# Altium project MSampler3.PrjPcb
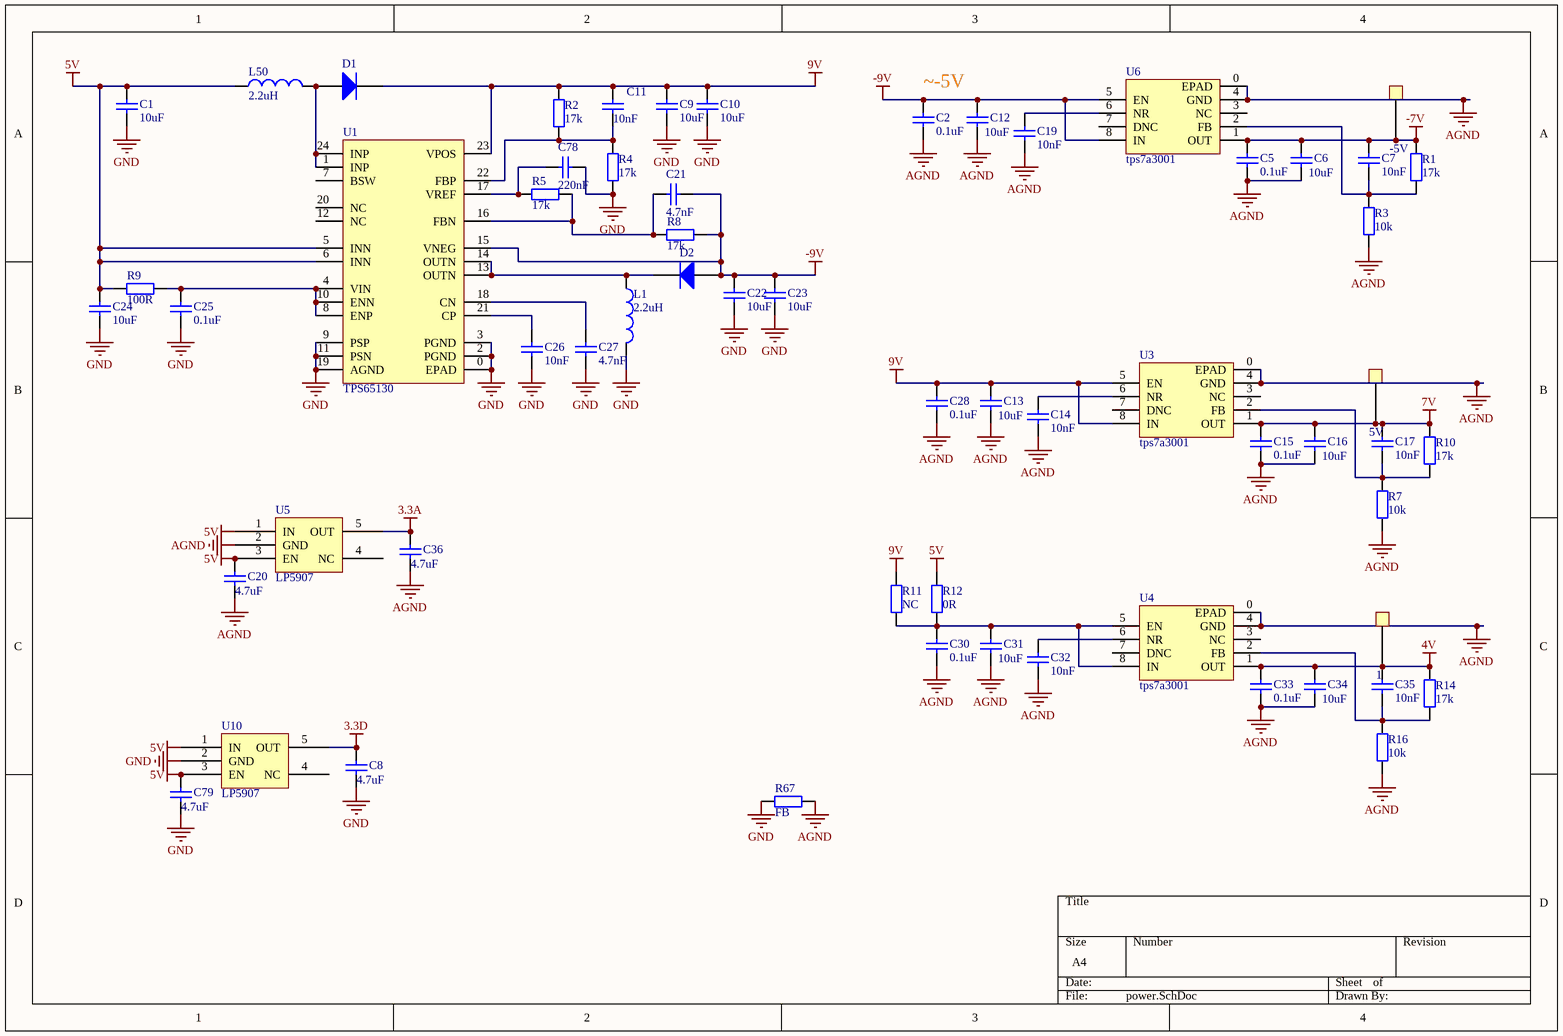
[diagram p0: power.SchDoc]
3 sheets, 179 parts. Net scope: flat (ports and power ports of the same name join across sheets).
Board file: MSampler3.PcbDoc
Sheets:
  power.SchDoc
  audio.SchDoc
  MCU.SchDoc

## Sheet power.SchDoc
size A4

### Parts
1  TestPad  [TestPad]  (value not drawn)
5V  TestPad  [TestPad]  (value not drawn)
-5V  TestPad  [TestPad]  (value not drawn)
C1  10uF  [0603L]
C2  0.1uF  [0603L]
C5  0.1uF  [0603L]
C6  10uF  [0805]
C7  10nF  [0402]
C8  4.7uF  [0603L]
C9  10uF  [0603L]
C10  10uF  [0603L]
C11  10nF  [0402]
C12  10uF  [0805]
C13  10uF  [0805]
C14  10nF  [0402]
C15  0.1uF  [0603L]
C16  10uF  [0805]
C17  10nF  [0402]
C19  10nF  [0402]
C20  4.7uF  [0603L]
C21  4.7nF  [0402]
C22  10uF  [0603L]
C23  10uF  [0603L]
C24  10uF  [0603L]
C25  0.1uF  [0402]
C26  10nF  [0402]
C27  4.7nF  [0402]
C28  0.1uF  [0603L]
C30  0.1uF  [0603L]
C31  10uF  [0805]
C32  10nF  [0402]
C33  0.1uF  [0603L]
C34  10uF  [0805]
C35  10nF  [0402]
C36  4.7uF  [0603L]
C78  220nF  [0402]
C79  4.7uF  [0603L]
D1  (no value)  [LC-SOD-323]
D2  (no value)  [LC-SOD-323]
L1  2.2uH  [L4015]
L50  2.2uH  [L4015]
R1  17k  [0402]
R2  17k  [0402]
R3  10k  [0402]
R4  17k  [0402]
R5  17k  [0402]
R7  10k  [0402]
R8  17k  [0402]
R9  100R  [0402]
R10  17k  [0402]
R11  NC  [0402]
R12  0R  [0402]
R14  17k  [0402]
R16  10k  [0402]
R67  FB  [0603L]
U1  TPS65130  [TPS65130]
U3  tps7a3001  [MSOP8/VSSOP8+PAD]
U4  tps7a3001  [MSOP8/VSSOP8+PAD]
U5  LP5907  [SOT23-5]
U6  tps7a3001  [MSOP8/VSSOP8+PAD]
U10  LP5907  [SOT23-5]

### Nets
3.3A: C36.2 U5.5(OUT)
3.3D: C8.2 U10.5(OUT)
4V: 1.1 C33.1 C34.2 C35.1 R14.2 U4.1(OUT)
5V: C1.1 C20.2 C24.1 C79.2 L50.1 R9.2 R12.2 U1.5(INN) U1.6(INN) U5.1(IN) U5.3(EN) U10.1(IN) U10.3(EN)
7V: 5V.1 C15.1 C16.2 C17.1 R10.2 U3.1(OUT)
9V: C9.1 C10.1 C11.1 C13.2 C28.1 D1.2(K) R2.2 R11.2 U1.23(VPOS) U3.5(EN) U3.8(IN)
-7V: -5V.1 C5.1 C6.2 C7.1 R1.2 U6.1(OUT)
-9V: C2.1 C12.2 C21.2 C22.1 C23.1 D2.1(A) R8.2 U1.15(VNEG) U6.5(EN) U6.8(IN)
AGND: C2.2 C5.2 C6.1 C12.1 C13.1 C14.2 C15.2 C16.1 C19.2 C20.1 C28.2 C30.2 C31.1 C32.2 C33.2 C34.1 C36.1 R3.1 R7.1 R16.1 R67.1 U3.0(EPAD) U3.4(GND) U4.0(EPAD) U4.4(GND) U5.2(GND) U6.0(EPAD) U6.4(GND)
GND: C1.2 C8.1 C9.2 C10.2 C22.2 C23.2 C24.2 C25.2 C26.2 C27.2 C78.2 C79.1 L1.2 R4.1 R67.2 U1.0(EPAD) U1.2(PGND) U1.3(PGND) U1.9(PSP) U1.11(PSN) U1.19(AGND) U10.2(GND)
NetC7_2: C7.2 R1.1 R3.2 U6.2(FB)
NetC11_2: C11.2 R2.1 R4.2 U1.22(FBP)
NetC14_1: C14.1 U3.6(NR)
NetC17_2: C17.2 R7.2 R10.1 U3.2(FB)
NetC19_1: C19.1 U6.6(NR)
NetC21_1: C21.1 R5.1 R8.1 U1.16(FBN)
NetC25_1: C25.1 R9.1 U1.4(VIN) U1.8(ENP) U1.10(ENN)
NetC26_1: C26.1 U1.21(CP)
NetC27_1: C27.1 U1.18(CN)
NetC30_1: C30.1 C31.2 R11.1 R12.1 U4.5(EN) U4.8(IN)
NetC32_1: C32.1 U4.6(NR)
NetC35_2: C35.2 R14.1 R16.2 U4.2(FB)
NetC78_1: C78.1 R5.2 U1.17(VREF)
NetD1_1: D1.1(A) L50.2 U1.1(INP) U1.24(INP)
NetD2_2: D2.2(K) L1.1 U1.13(OUTN) U1.14(OUTN)

Not connected (* = marked no-connect by the designer): U1 7(BSW) 12(NC) 20(NC); U3 3(NC) 7(DNC); U4 3(NC) 7(DNC); U5 4(NC); U6 3(NC) 7(DNC); U10 4(NC)

### Notes on the sheet
- ~-5V

### Library data of the parts
C1 C2 C5-C17 C19-C28 C30-C36 C78 C79 = Cap: Capacitor; Published: 8-Jun-2000; LatestRevisionDate: 17-Jul-2002; LatestRevisionNote: Re-released for DXP Platform.; PackageReference: RAD-0.3; Publisher: Altium Limited; PackageDescription: Radial Cap, Thru-Hole; 2 Leads; 0.3 in Pin Spacing
D1 D2 = Diode 1N4148: High Conductance Fast Diode; Published: 8-Jun-2000; LatestRevisionDate: 17-Jul-2002; LatestRevisionNote: Re-released for DXP Platform.; DatasheetVersion: 1997; PackageReference: DO-35; Publisher: Altium Limited; PackageDescription: Diode, Axial; Body 3.8 x 1.9 mm (LxDia. max), Lead Dia. 0.53 mm (max); Code_JEDEC: DO-204-AH; ComponentLink1Description: Manufacturer Link; ComponentLink1URL: http://www.fairchildsemi.com/; ComponentLink2Description: Datasheet; ComponentLink2URL: http://www.fairchildsemi.com/ds/1N%2F1N4148.pdf
L1 L50 = Inductor: Code_IEC: 1005; Published: 8-Jun-2000; LatestRevisionDate: 29-May-2009; LatestRevisionNote: IPC-7351 Footprint Added.; PackageReference: 0402-A; Publisher: Altium Limited; PackageDescription: Chip Inductor; Code_JEITA: 0402
R1-R5 R7-R12 R14 R16 R67 = Res2: Resistor; Published: 8-Jun-2000; LatestRevisionDate: 17-Jul-2002; LatestRevisionNote: Re-released for DXP Platform.; PackageReference: AXIAL-0.4; Publisher: Altium Limited; PackageDescription: Axial Device, Thru-Hole; 2 Leads; 0.4 in Pin Spacing

## Sheet audio.SchDoc
size A3
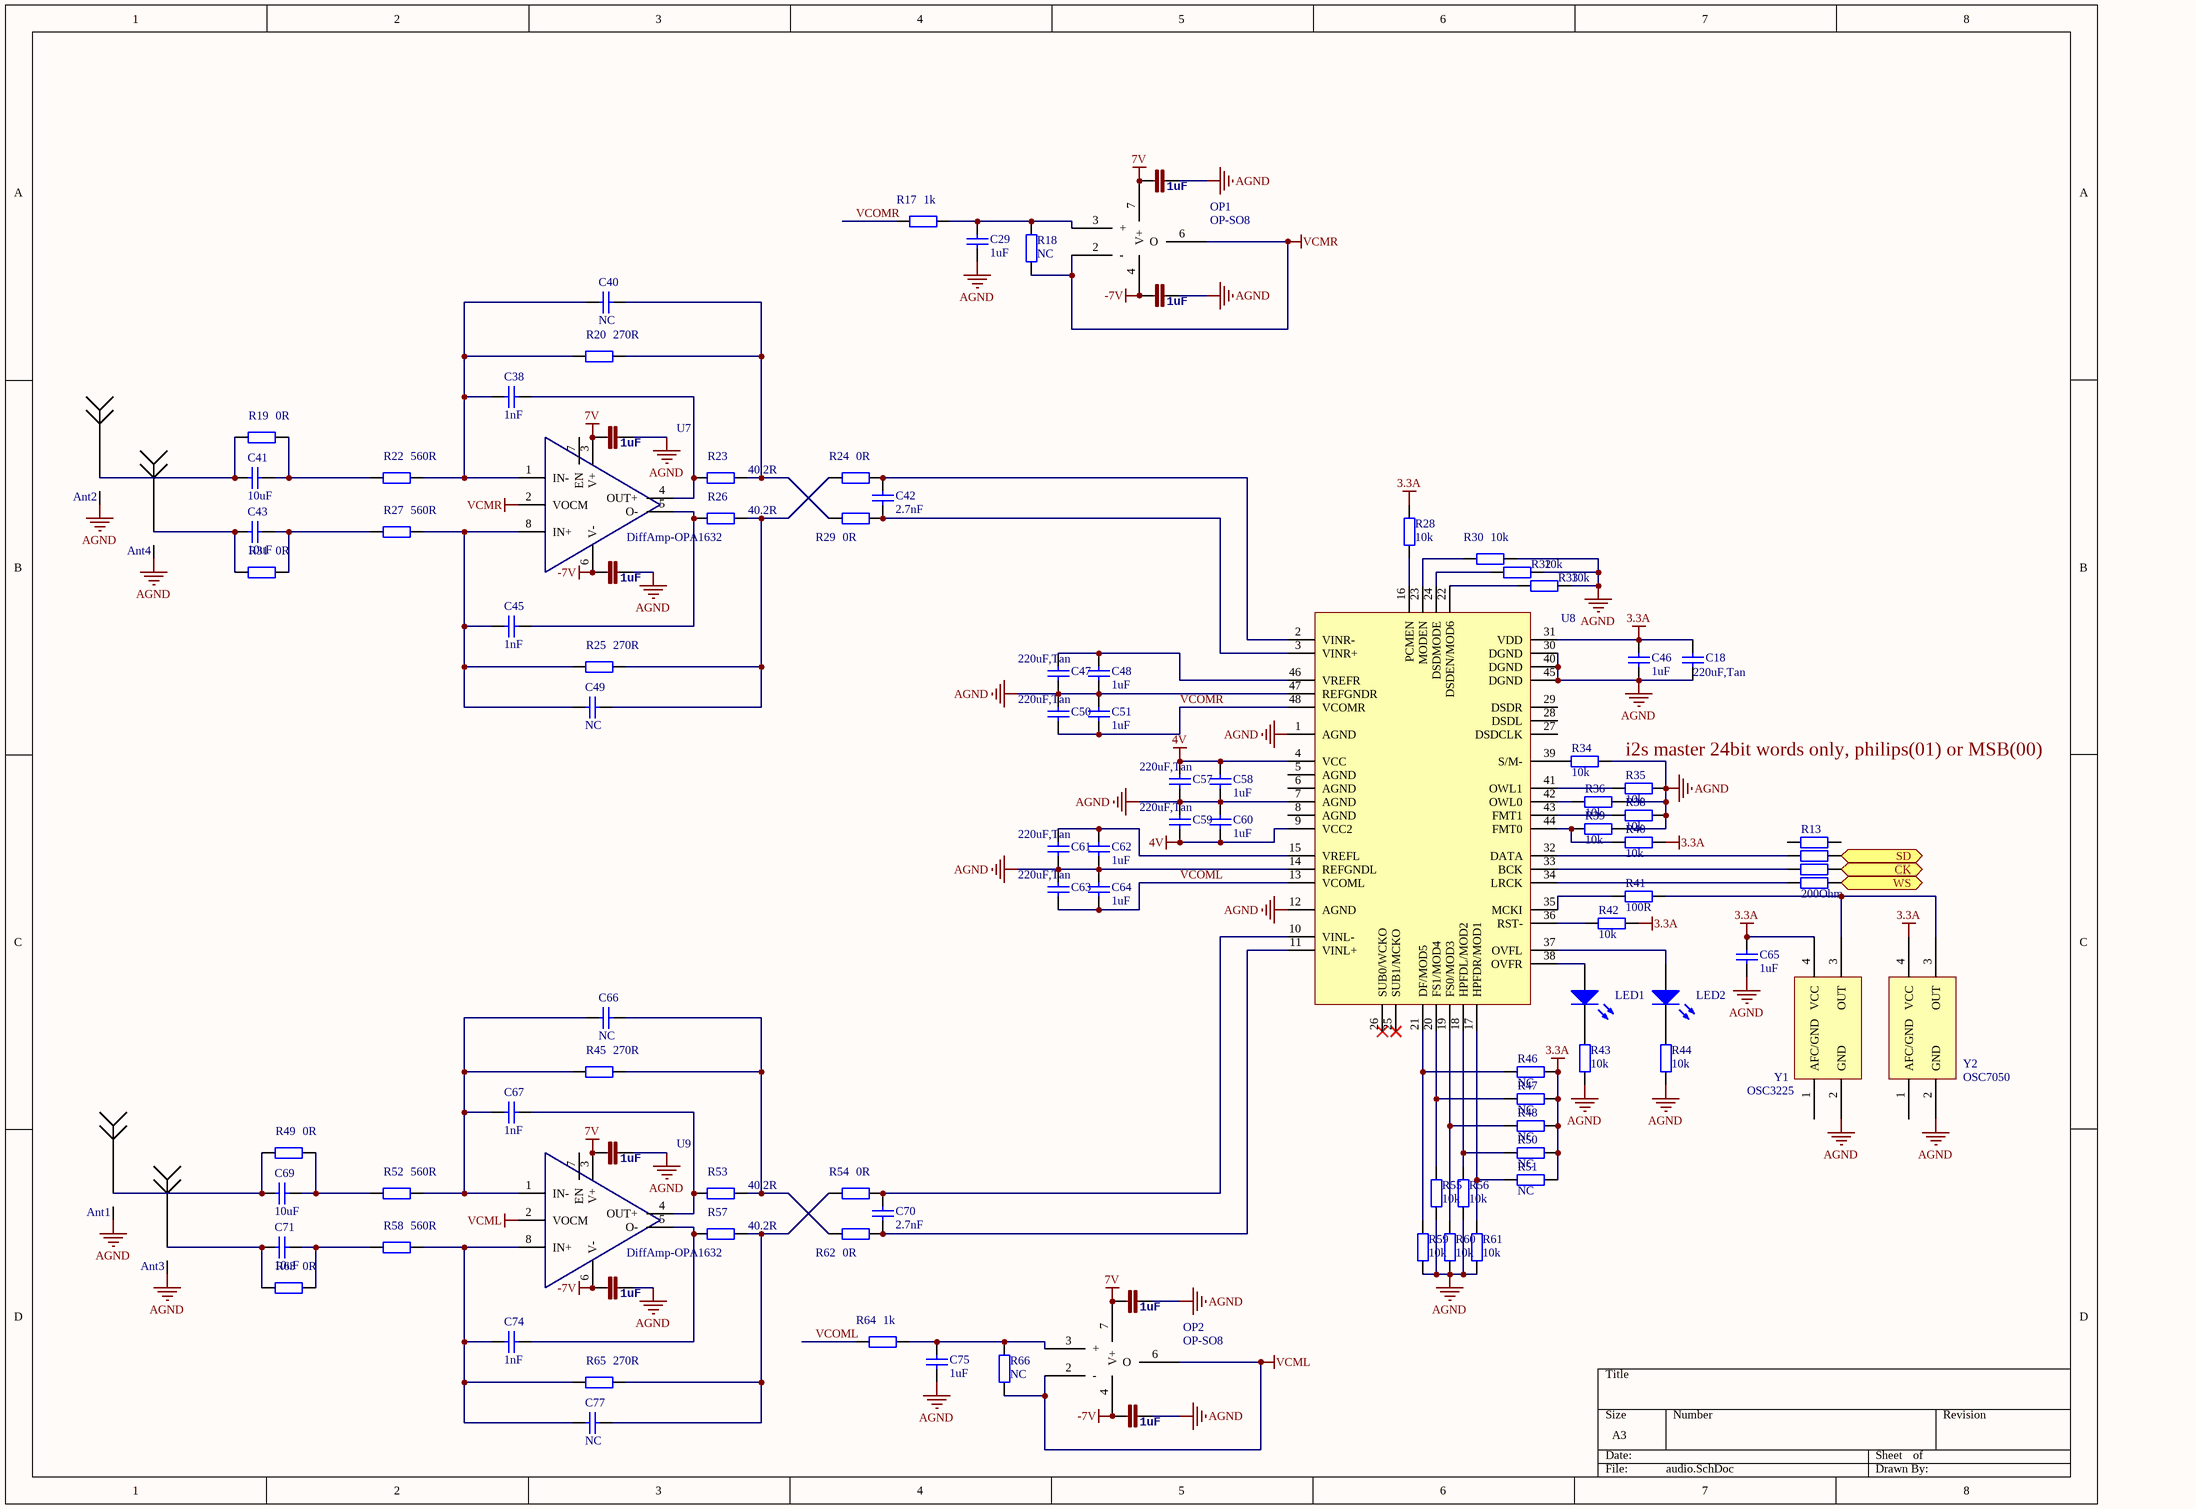
[diagram p1: audio.SchDoc]

### Parts
Ant1  Antenna  [SMA-2C]  (value not drawn)
Ant2  Antenna  [SMA-2C]  (value not drawn)
Ant3  Antenna  [SMA-2C]  (value not drawn)
Ant4  Antenna  [SMA-2C]  (value not drawn)
C18  220uF,Tan  [1210]
C29  1uF  [0402]
C37  1uF  [0603L]
C38  1nF  [0805]
C39  1uF  [0603L]
C40  NC  [0805]
C41  10uF  [CL21-5mm-1F]
C42  2.7nF  [0805]
C43  10uF  [CL21-5mm-1F]
C44  1uF  [0603L]
C45  1nF  [0805]
C46  1uF  [0402]
C47  220uF,Tan  [1210]
C48  1uF  [0402]
C49  NC  [0805]
C50  220uF,Tan  [1210]
C51  1uF  [0402]
C57  220uF,Tan  [1210]
C58  1uF  [0402]
C59  220uF,Tan  [1210]
C60  1uF  [0402]
C61  220uF,Tan  [1210]
C62  1uF  [0402]
C63  220uF,Tan  [1210]
C64  1uF  [0402]
C65  1uF  [0402]
C66  NC  [0805]
C67  1nF  [0805]
C68  1uF  [0603L]
C69  10uF  [CL21-5mm-1F]
C70  2.7nF  [0805]
C71  10uF  [CL21-5mm-1F]
C72  1uF  [0603L]
C73  1uF  [0603L]
C74  1nF  [0805]
C75  1uF  [0402]
C76  1uF  [0603L]
C77  NC  [0805]
C89  1uF  [0603L]
LED1  LED0  [0603]  (value not drawn)
LED2  LED0  [0603]  (value not drawn)
OP1  OP-SO8  [D8]
OP2  OP-SO8  [D8]
R13  value 200Ohm  [0402X4]  (hidden comment: Res*4)
R17  1k  [0402]
R18  NC  [0402]
R19  0R  [0402]
R20  270R  [0402]
R22  560R  [0402]
R23  40.2R  [0805]
R24  0R  [0402]
R25  270R  [0402]
R26  40.2R  [0805]
R27  560R  [0402]
R28  10k  [0402]
R29  0R  [0402]
R30  10k  [0402]
R31  0R  [0402]
R32  10k  [0402]
R33  10k  [0402]
R34  10k  [0402]
R35  10k  [0402]
R36  10k  [0402]
R38  10k  [0402]
R39  10k  [0402]
R40  10k  [0402]
R41  100R  [0402]
R42  10k  [0402]
R43  10k  [0402]
R44  10k  [0402]
R45  270R  [0402]
R46  NC  [0402]
R47  NC  [0402]
R48  NC  [0402]
R49  0R  [0402]
R50  NC  [0402]
R51  NC  [0402]
R52  560R  [0402]
R53  40.2R  [0805]
R54  0R  [0402]
R55  10k  [0402]
R56  10k  [0402]
R57  40.2R  [0805]
R58  560R  [0402]
R59  10k  [0402]
R60  10k  [0402]
R61  10k  [0402]
R62  0R  [0402]
R63  0R  [0402]
R64  1k  [0402]
R65  270R  [0402]
R66  NC  [0402]
U7  DiffAmp-OPA1632  [MSOP8/VSSOP8]
U8  PCM4222-FUNC  [PCM4222]  (value not drawn)
U9  DiffAmp-OPA1632  [MSOP8/VSSOP8]
Y1  OSC3225  [TXC_7Q]
Y2  OSC7050  [OSC7050]

### Ports
CK, SD, WS

### Nets
3.3A: C18.2 C46.2 C65.2 R28.1 R40.2 R42.2 R46.1 R47.2 R48.2 R50.2 R51.1 U8.31(VDD) Y1.4(VCC) Y2.4(VCC)
4V: C57.1 C58.2 C59.2 C60.1 U8.4(VCC) U8.9(VCC2)
7V: C39.2 C68.2 C73.2 C89.2 OP1.7(V+) OP2.7(V+) U7.3(V+) U9.3(V+)
-7V: C37.2 C44.2 C72.2 C76.2 OP1.4 OP2.4 U7.6(V-) U9.6(V-)
AGND: Ant1.GND(G) Ant2.GND(G) Ant3.GND(G) Ant4.GND(G) C18.1 C29.1 C37.1 C39.1 C44.1 C46.1 C47.2 C48.1 C50.1 C51.2 C57.2 C58.1 C59.1 C60.2 C61.2 C62.1 C63.1 C64.2 C65.1 C68.1 C72.1 C73.1 C75.1 C76.1 C89.1 R30.1 R32.1 R33.1 R34.2 R35.2 R36.2 R38.2 R39.2 R43.2 R44.2 R55.1 R56.1 R59.1 R60.1 R61.1 U8.1(AGND) U8.7(AGND) U8.12(AGND) U8.14(REFGNDL) U8.30(DGND) U8.40(DGND) U8.45(DGND) U8.47(REFGNDR) Y1.2(GND) Y2.2(GND)
VCML: OP2.2(-) OP2.6(O) R66.2 U9.2(VOCM)
VCMR: OP1.2(-) OP1.6(O) R18.2 U7.2(VOCM)
PA15: R13.8 ; port WS
VCOML: C63.2 C64.1 R64.2 U8.13(VCOML)
VCOMR: C50.2 C51.1 R17.2 U8.48(VCOMR)
NetAnt1_1: Ant1.1 C69.2 R49.2
NetAnt2_1: Ant2.1 C41.2 R19.2
NetAnt3_1: Ant3.1 C71.2 R63.2
NetAnt4_1: Ant4.1 C43.2 R31.2
NetC29_2: C29.2 OP1.3(+) R17.1 R18.1
NetC38_1: C38.1 R23.2 U7.4(OUT+)
NetC38_2: C38.2 C40.2 R20.2 R22.1 U7.1(IN-)
NetC40_1: C40.1 R20.1 R23.1 R29.2
NetC41_1: C41.1 R19.1 R22.2
NetC42_1: C42.1 R24.1 U8.2(VINR-)
NetC42_2: C42.2 R29.1 U8.3(VINR+)
NetC43_1: C43.1 R27.2 R31.1
NetC45_1: C45.1 R26.2 U7.5(O-)
NetC45_2: C45.2 C49.2 R25.2 R27.1 U7.8(IN+)
NetC47_1: C47.1 C48.2 U8.46(VREFR)
NetC49_1: C49.1 R24.2 R25.1 R26.1
NetC61_1: C61.1 C62.2 U8.15(VREFL)
NetC66_1: C66.1 R45.1 R53.1 R62.2
NetC66_2: C66.2 C67.2 R45.2 R52.1 U9.1(IN-)
NetC67_1: C67.1 R53.2 U9.4(OUT+)
NetC69_1: C69.1 R49.1 R52.2
NetC70_1: C70.1 R54.1 U8.10(VINL-)
NetC70_2: C70.2 R62.1 U8.11(VINL+)
NetC71_1: C71.1 R58.2 R63.1
NetC74_1: C74.1 R57.2 U9.5(O-)
NetC74_2: C74.2 C77.2 R58.1 R65.2 U9.8(IN+)
NetC75_2: C75.2 OP2.3(+) R64.1 R66.1
NetC77_1: C77.1 R54.2 R57.1 R65.1
NetLED1_1: LED1.1(A) U8.38(OVFR)
NetLED1_2: LED1.2(K) R43.1
NetLED2_1: LED2.1(A) U8.37(OVFL)
NetLED2_2: LED2.2(K) R44.1
NetR13_1: R13.1 U8.34(LRCK)
NetR13_2: R13.2 U8.33(BCK)
NetR13_3: R13.3 U8.32(DATA)
NetR13_6: R13.6 ; port SD
NetR13_7: R13.7 ; port CK
NetR28_2: R28.2 U8.16(PCMEN)
NetR30_2: R30.2 U8.23(MODEN)
NetR32_2: R32.2 U8.24(DSDMODE)
NetR33_2: R33.2 U8.22(DSDEN/MOD6)
NetR34_1: R34.1 U8.39(S/M-)
NetR35_1: R35.1 U8.41(OWL1)
NetR36_1: R36.1 U8.42(OWL0)
NetR38_1: R38.1 U8.43(FMT1)
NetR39_1: R39.1 R40.1 U8.44(FMT0)
NetR41_1: R41.1 U8.35(MCKI)
NetR41_2: R41.2 Y1.3(OUT) Y2.3(OUT)
NetR42_1: R42.1 U8.36(RST-)
NetR46_2: R46.2 R59.2 U8.21(DF/MOD5)
NetR47_1: R47.1 R55.2 U8.20(FS1/MOD4)
NetR48_1: R48.1 R60.2 U8.19(FS0/MOD3)
NetR50_1: R50.1 R56.2 U8.18(HPFDL/MOD2)
NetR51_2: R51.2 R61.2 U8.17(HPFDR/MOD1)

Not connected (* = marked no-connect by the designer): R13 4 5; U7 7(EN); U8 5(AGND) 6(AGND) 8(AGND) 25(SUB1/MCKO)* 26(SUB0/WCKO)* 27(DSDCLK) 28(DSDL) 29(DSDR); U9 7(EN); Y1 1(AFC/GND); Y2 1(AFC/GND)

### Notes on the sheet
- i2s master 24bit words only, philips(01) or MSB(00)

### Library data of the parts
C18 C29 C38 C40-C43 C45-C51 C57-C67 C69-C71 C74 C75 C77 = Cap: Capacitor
  C18 C38 C40-C43 C45 C47 C49 C50 C57 C59 C61 C63 C66 C67 C69-C71 C74 C77: Published: 8-Jun-2000; LatestRevisionDate: 17-Jul-2002; LatestRevisionNote: Re-released for DXP Platform.; PackageReference: RAD-0.3; Publisher: Altium Limited; PackageDescription: Radial Cap, Thru-Hole; 2 Leads; 0.3 in Pin Spacing
C37 C39 C44 C68 C72 C73 C76 C89 = CAP0402-CAP: <b>Capacitor</b> / Standard 0603 ceramic capacitor, and 0.1" leaded capacitor.; PARTNO: CC0402ZRY5V7BB104
LED1 LED2 = LED0: Typical INFRARED GaAs LED; Published: 8-Jun-2000; LatestRevisionDate: 08-Jul-2005; LatestRevisionNote: Mech Layer 1 removed.; PackageReference: LED-0; Publisher: Altium Limited; PackageDescription: LED; 2 Leads
R13 = Res*4: Resistor; Published: 8-Jun-2000; LatestRevisionDate: 17-Jul-2002; LatestRevisionNote: Re-released for DXP Platform.; PackageReference: AXIAL-0.4; Publisher: Altium Limited; PackageDescription: Axial Device, Thru-Hole; 2 Leads; 0.4 in Pin Spacing
R17 R18 R23 R24 R26 R28-R30 R32 R33 R53 R54 R57 R62 R64 R66 = Res2: Resistor; Published: 8-Jun-2000; LatestRevisionDate: 17-Jul-2002; LatestRevisionNote: Re-released for DXP Platform.; PackageReference: AXIAL-0.4; Publisher: Altium Limited; PackageDescription: Axial Device, Thru-Hole; 2 Leads; 0.4 in Pin Spacing
R19 R20 R22 R25 R27 R31 R34-R36 R38-R52 R55 R56 R58-R61 R63 R65 = Res2: Resistor; Value: 0Ohm; Published: 8-Jun-2000; LatestRevisionDate: 17-Jul-2002; LatestRevisionNote: Re-released for DXP Platform.; PackageReference: AXIAL-0.4; Publisher: Altium Limited; PackageDescription: Axial Device, Thru-Hole; 2 Leads; 0.4 in Pin Spacing
U7 U9 = DiffAmp
Y1 Y2 = OSC_40M

## Sheet MCU.SchDoc
size A4
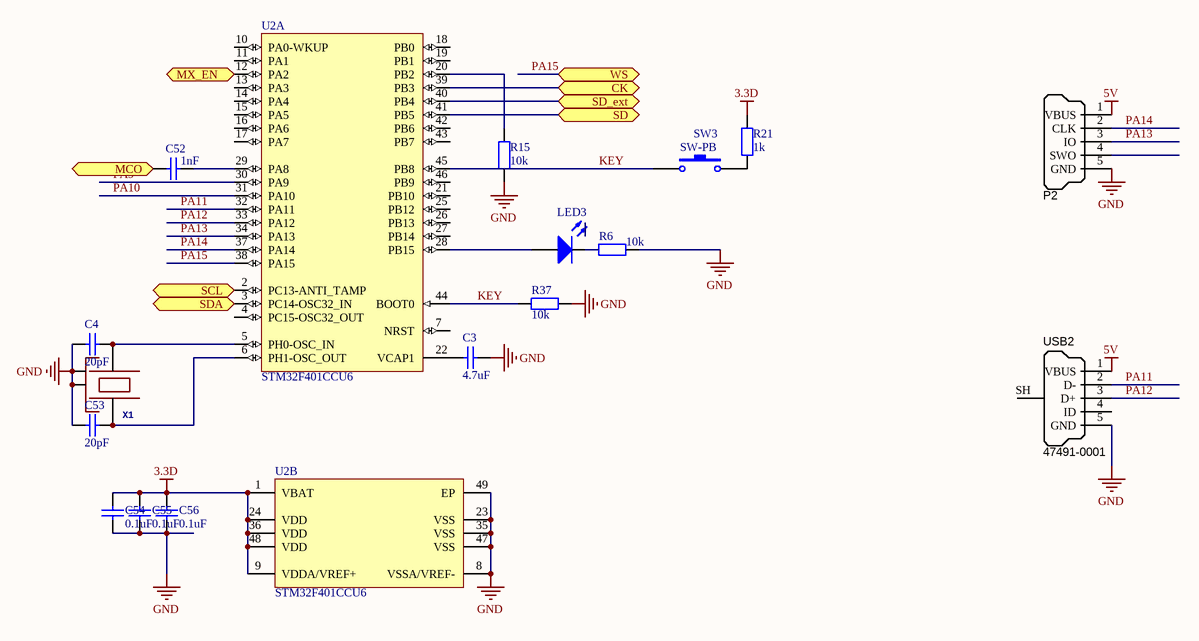
[diagram p2: MCU.SchDoc]

### Parts
C3  value 4.7uF  [0603L]  (hidden comment: Cap)
C4  value 20pF  [0402]  (hidden comment: Cap)
C52  1nF  [0402]
C53  value 20pF  [0402]  (hidden comment: Cap)
C54  value 0.1uF  [0402]  (hidden comment: Cap)
C55  value 0.1uF  [0402]  (hidden comment: Cap)
C56  value 0.1uF  [0402]  (hidden comment: Cap)
LED3  LED0  [0603]  (value not drawn)
P2  SWD_MicroUSB  [MICRO-YZX]  (value not drawn)
R6  10k  [0402]
R15  10k  [0402]
R21  1k  [0402]
R37  value 10k  [0402]  (hidden comment: Res2)
SW3  SW-PB  [SW3x4]
U2  STM32F401CCU6  [STM-UFQFPN48_N]  (parts A,B of 2)
USB2  Manufacturer Part Number 1: 47491-0001  [MICRO-YZX]  (hidden comment: USB Micro Type B)
X1  24.000 KHz 3.2x2.5mm 8-10pf  [OSCILLATOR-2.5x2.0]  (value not drawn)

### Ports
CK, MCO, MX_EN, SCL, SD, SD_ext, SDA, WS

### Nets
3.3D: C54.2 C55.2 C56.2 R21.2 U2.1(VBAT) U2.9(VDDA/VREF+) U2.24(VDD) U2.36(VDD) U2.48(VDD)
5V: P2.1(VBUS) USB2.1(VBUS)
GND: C3.1 C4.1 C53.1 C54.1 C55.1 C56.1 P2.5(GND) R6.2 R15.2 R37.2 U2.8(VSSA/VREF-) U2.23(VSS) U2.35(VSS) U2.47(VSS) U2.49(EP) USB2.5(GND) X1.2(NC_2) X1.4(NC_4)
KEY: R37.1 SW3.1 U2.44(BOOT0) U2.45(PB8)
PA9: U2.30(PA9)
PA10: U2.31(PA10)
PA11: U2.32(PA11) USB2.2(D-)
PA12: U2.33(PA12) USB2.3(D+)
PA13: P2.3(IO) U2.34(PA13)
PA14: P2.2(CLK) U2.37(PA14)
PA15: U2.38(PA15) ; port WS
NetC3_2: C3.2 U2.22(VCAP1)
NetC4_2: C4.2 U2.5(PH0-OSC_IN) X1.1
NetC52_1: C52.1 ; port MCO
NetC52_2: C52.2 U2.29(PA8)
NetC53_2: C53.2 U2.6(PH1-OSC_OUT) X1.3
NetLED3_1: LED3.1(A) U2.28(PB15)
NetLED3_2: LED3.2(K) R6.1
NetR13_6: U2.41(PB5) ; port SD
NetR13_7: U2.39(PB3) ; port CK
NetR15_1: R15.1 U2.20(PB2)
NetR21_1: R21.1 SW3.2
NetU2_2: U2.2(PC13-ANTI_TAMP) ; port SCL
NetU2_3: U2.3(PC14-OSC32_IN) ; port SDA
NetU2_12: U2.12(PA2) ; port MX_EN
NetU2_40: U2.40(PB4) ; port SD_ext

Not connected (* = marked no-connect by the designer): P2 4(SWO); U2 4(PC15-OSC32_OUT) 7(NRST) 10(PA0-WKUP) 11(PA1) 13(PA3) 14(PA4) 15(PA5) 16(PA6) 17(PA7) 18(PB0) 19(PB1) 21(PB10) 25(PB12) 26(PB13) 27(PB14) 42(PB6) 43(PB7) 46(PB9); USB2 4(ID) SH(Shell)

### Library data of the parts
C3 C4 C52-C56 = Cap: Capacitor
  C3 C4 C53-C56: Published: 8-Jun-2000; LatestRevisionDate: 17-Jul-2002; LatestRevisionNote: Re-released for DXP Platform.; PackageReference: RAD-0.3; Publisher: Altium Limited; PackageDescription: Radial Cap, Thru-Hole; 2 Leads; 0.3 in Pin Spacing
LED3 = LED0: Typical INFRARED GaAs LED; Published: 8-Jun-2000; LatestRevisionDate: 08-Jul-2005; LatestRevisionNote: Mech Layer 1 removed.; PackageReference: LED-0; Publisher: Altium Limited; PackageDescription: LED; 2 Leads
P2 = SWD_MicroUSB: Connector SMD USB Micro Type B middle mount; Manufacturer 1: Molex Inc; SCDType: undef; Package / Case: SMD; Supplier 1: Digi-Key; Supplier Part Number 1: WM17142CT-ND
R6 R15 R21 = Res2: Resistor; Value: 0Ohm; Published: 8-Jun-2000; LatestRevisionDate: 17-Jul-2002; LatestRevisionNote: Re-released for DXP Platform.; PackageReference: AXIAL-0.4; Publisher: Altium Limited; PackageDescription: Axial Device, Thru-Hole; 2 Leads; 0.4 in Pin Spacing
R37 = Res2: Resistor; Published: 8-Jun-2000; LatestRevisionDate: 17-Jul-2002; LatestRevisionNote: Re-released for DXP Platform.; PackageReference: AXIAL-0.4; Publisher: Altium Limited; PackageDescription: Axial Device, Thru-Hole; 2 Leads; 0.4 in Pin Spacing
SW3 = SW-PB: Switch; Published: 24-Mar-1999; LatestRevisionDate: 17-Jul-2002; LatestRevisionNote: Re-released for DXP Platform.; PackageReference: SPST-2; Publisher: Altium Limited; PackageDescription: Switch; 2 Leads
U2 = STM32F401CCU6: ARM Cortex-M4 32-bit MCU+FPU, 105 DMIPS, 256 kB Flash, 64 kB Internal RAM, 36 I/Os, 48-pin UFQFPN, -40 to 85 degC, Tray; Manufacturer: STMicroelectronics; FLASH Size (Prog) (kB): 256; I/Os (High Current): 36; Internal RAM Size (kB): 64; Operating Frequency(F) (Processor speed) (MHz): 84; Supply Voltage(Vcc) max (V): 3.6; Supply Voltage(Vcc) min (V): 1.8; DatasheetVersion: Rev. 1; PackageVersion: Rev. 1, 04/2013; PackageReference: UFQFPN48; PackageDescription: 48-Pin Ultra Thin Fine Pitch Quad Flat No-Lead, 7 x 7 x 0.6 mm Body, 0.5 mm Pitch, Exposed Pad; Supplier 1: Newark; Supplier Part Number 1: 19X6217; Supplier 2: Mouser; Supplier Part Number 2: 511-STM32F401CCU6; Core: ARM Cortex-M4; Packing: Tray; Mounting Technology: Surface Mount; PartNumber: STM32F401CCU6; ComponentLink1Description: Manufacturer URL; ComponentLink1URL: http://www.st.com/web/en/home.html; ComponentLink2Description: Datasheet; ComponentLink2URL: http://www.st.com/st-web-ui/static/active/en/resource/technical/document/data_brief/DM00071938.pdf; ComponentLink3Description: Package Specification; ComponentLink3URL: http://www.st.com/st-web-ui/static/active/en/resource/technical/document/data_brief/DM00071938.pdf
USB2 = USB_Micro_TypeB: Connector SMD USB Micro Type B middle mount; Manufacturer 1: Molex Inc; SCDType: undef; Package / Case: SMD; Supplier 1: Digi-Key; Supplier Part Number 1: WM17142CT-ND
X1 = OSCILLATOR-3.2X2.5: Crystal Oscillator in 3.2x2.5 SMD

## Nets that join several sheets
3.3A: power (C36.2 U5.5), audio (14 pins)
3.3D: power (C8.2 U10.5), MCU (9 pins)
4V: power (6 pins), audio (6 pins)
5V: power (13 pins), MCU (P2.1 USB2.1)
7V: power (6 pins), audio (8 pins)
-7V: power (6 pins), audio (8 pins)
AGND: power (28 pins), audio (54 pins)
GND: power (22 pins), MCU (18 pins)
NetR13_6: audio (R13.6), MCU (U2.41)
NetR13_7: audio (R13.7), MCU (U2.39)
PA15: audio (R13.8), MCU (U2.38)